# Altium schematic sheet BlasterAmp_SH1.SchDoc
size 647 x 419 mm; SheetNumber: 1; SheetTotal: 1
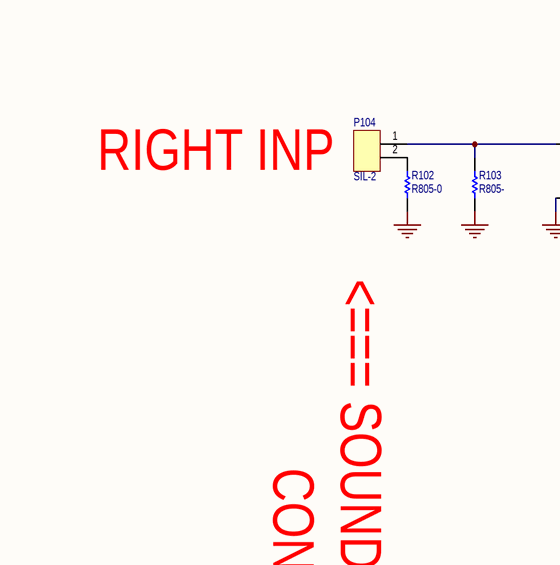
[diagram p0: BlasterAmp_SH1.SchDoc, top left]
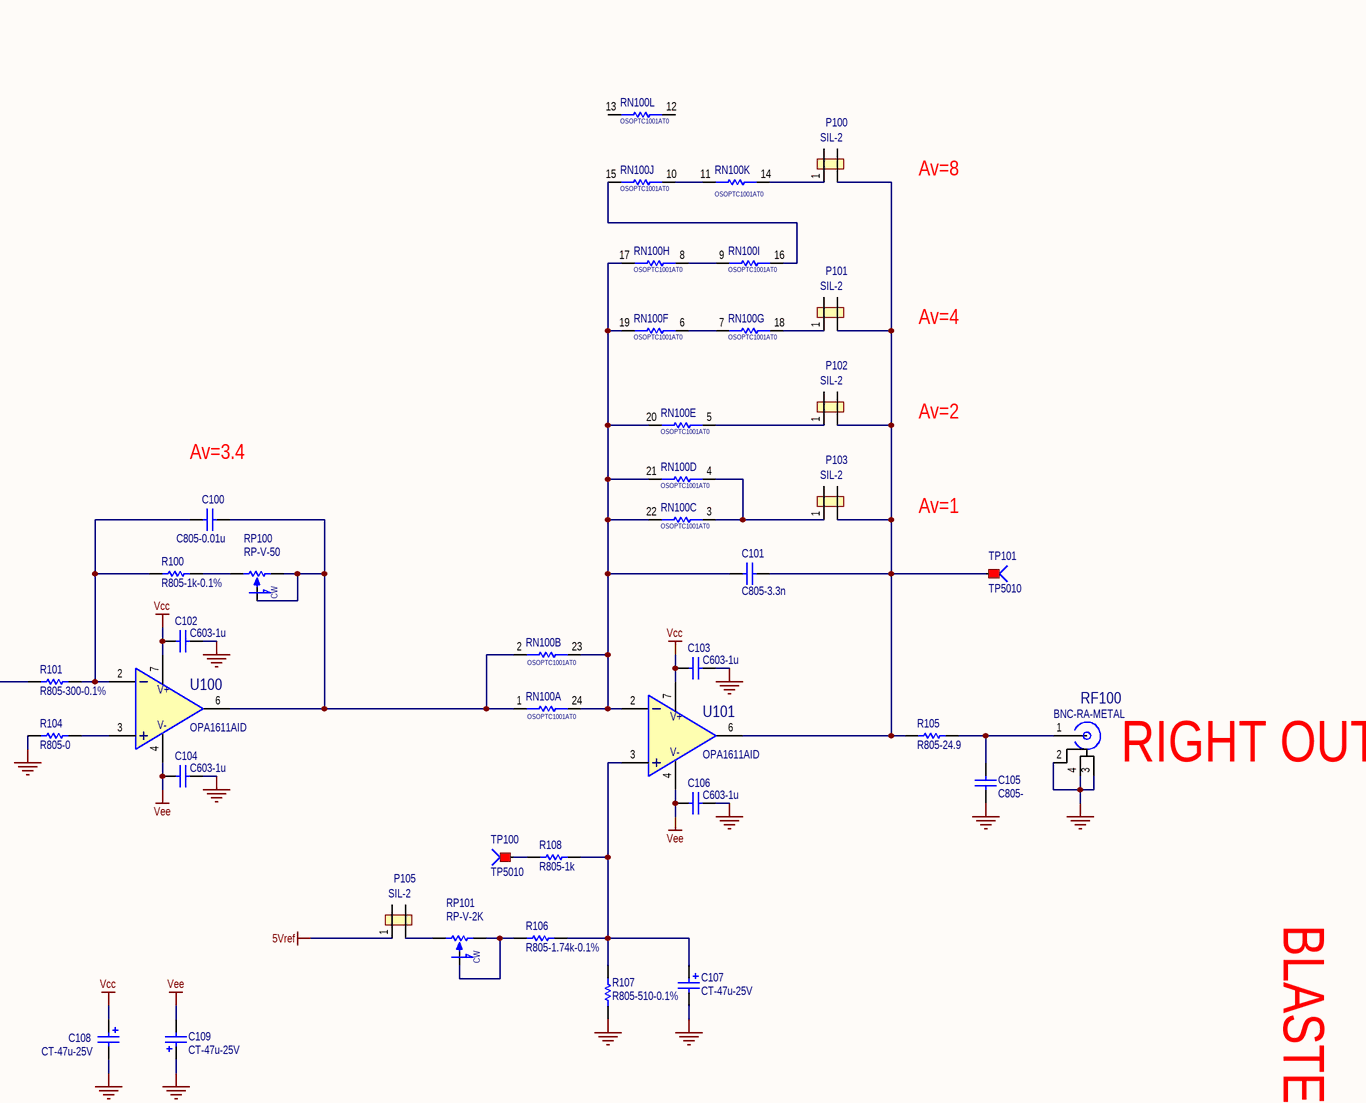
[diagram p1: BlasterAmp_SH1.SchDoc, top right]
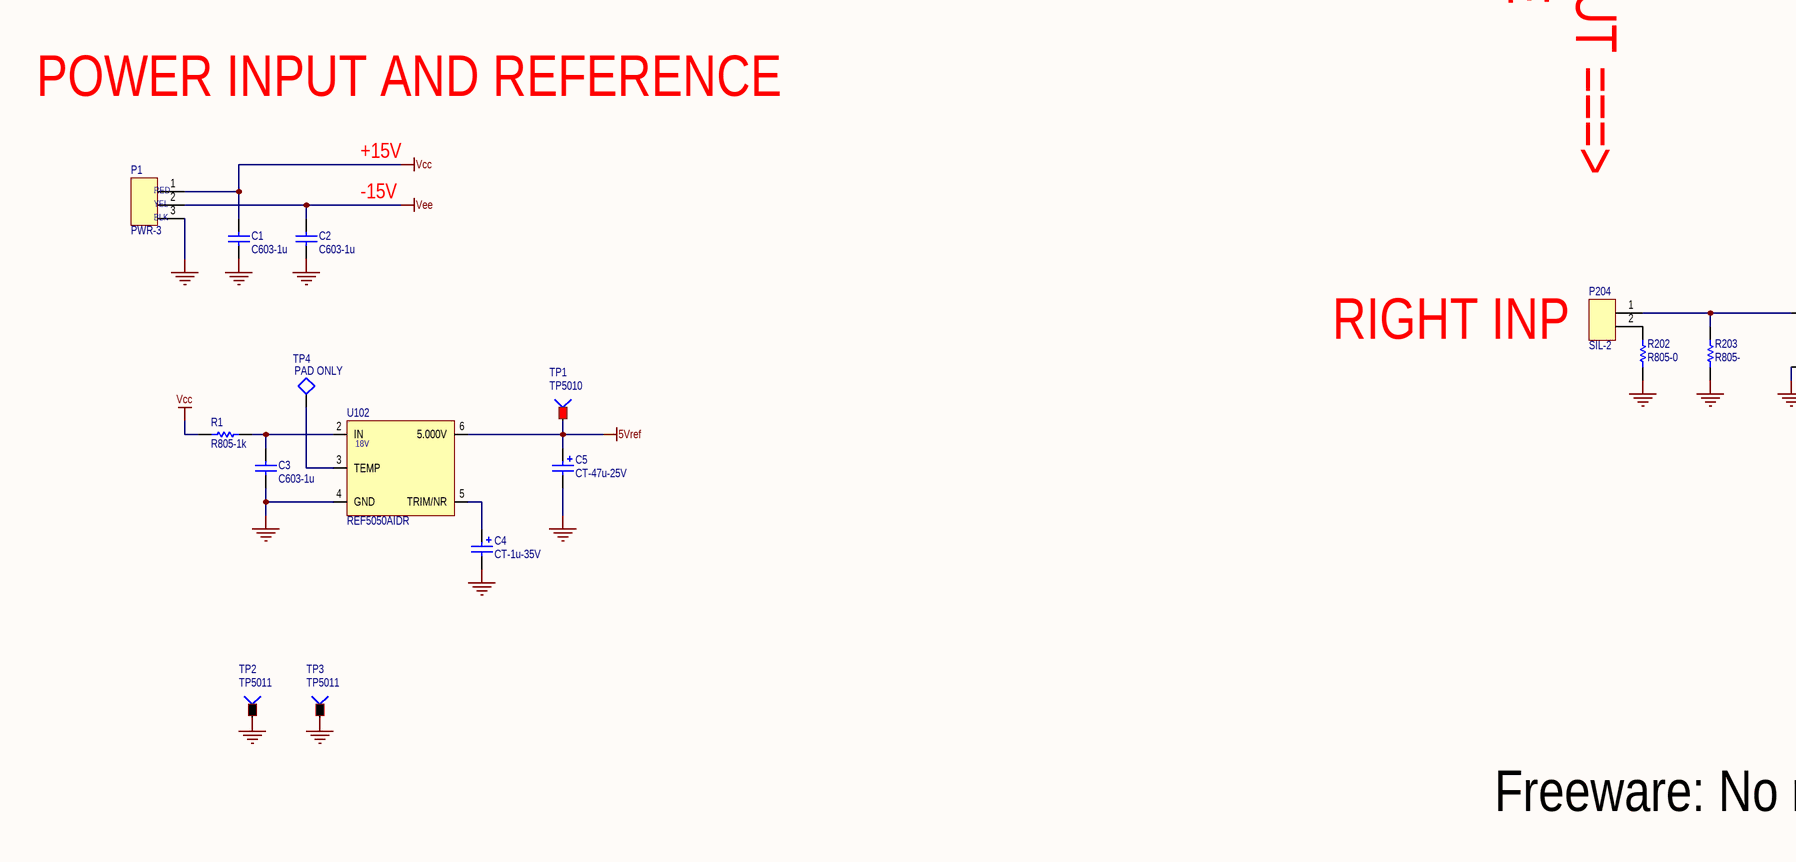
[diagram p2: BlasterAmp_SH1.SchDoc, bottom left]
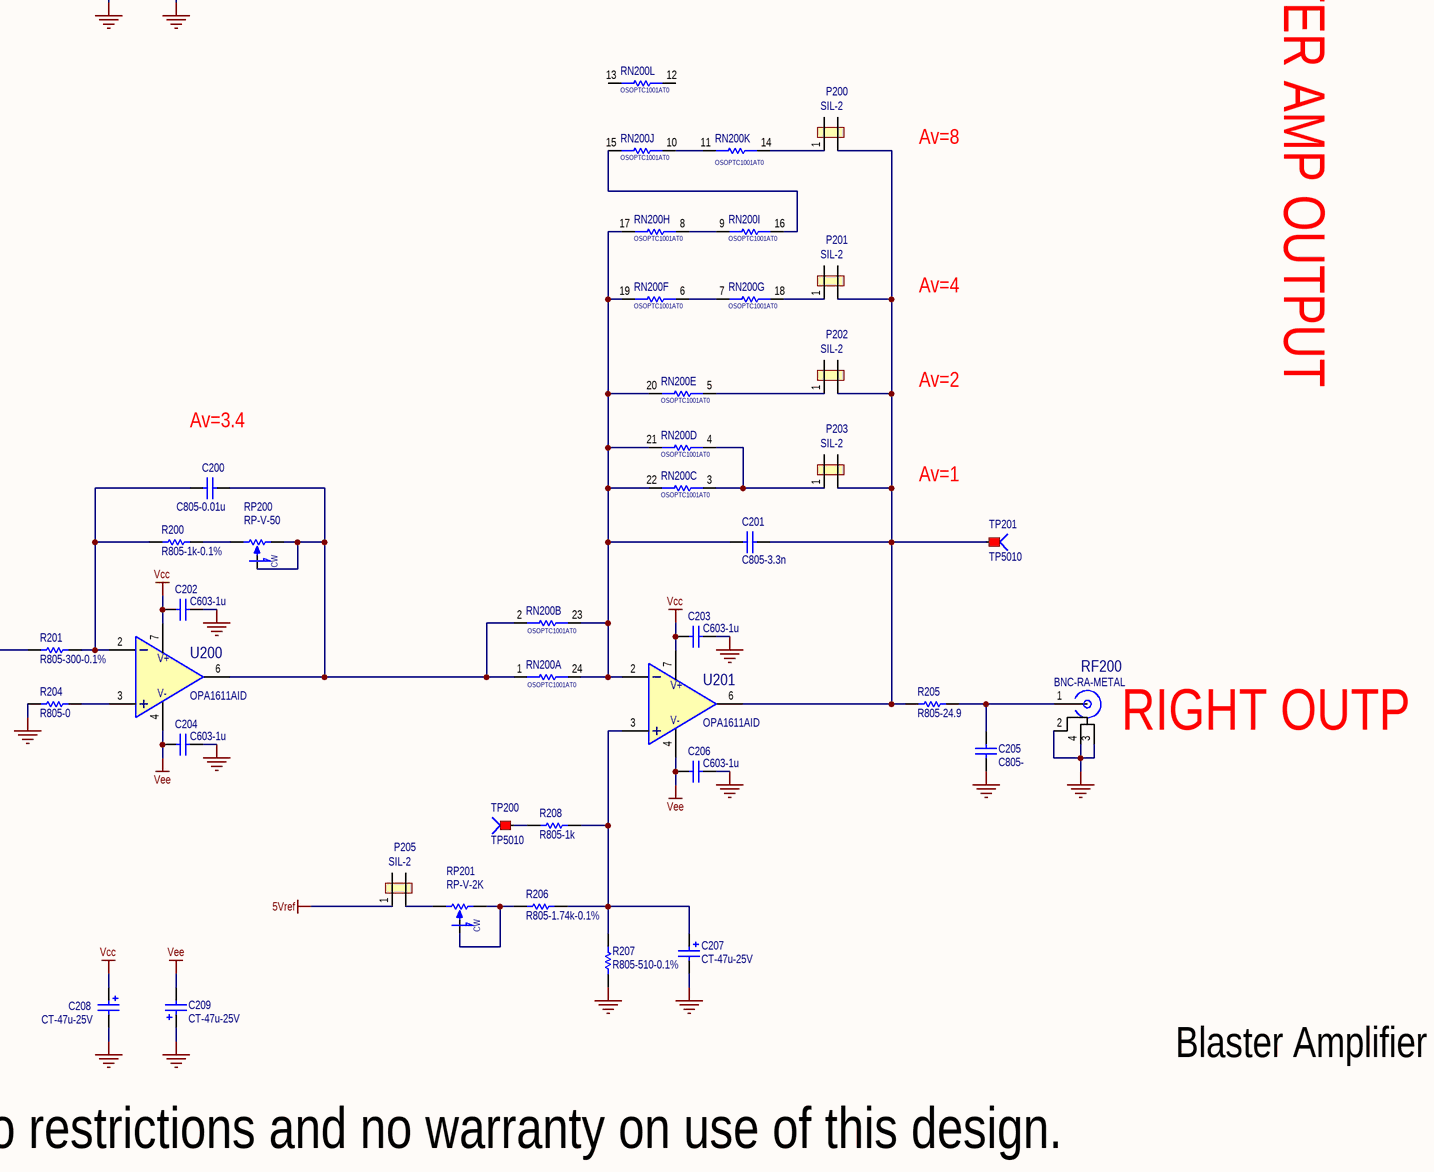
[diagram p3: BlasterAmp_SH1.SchDoc, bottom right]

## Parts
?  (no value)  (graphical)
C1  C603-1u  [0603]
C2  C603-1u  [0603]
C3  C603-1u  [0603]
C4  CT-1u-35V  [3528-21]
C5  CT-47u-25V  [7343-31]
C100  C805-0.01u  [0805]
C101  C805-3.3n  [0805]
C102  C603-1u  [0603]
C103  C603-1u  [0603]
C104  C603-1u  [0603]
C105  C805-  [0805]
C106  C603-1u  [0603]
C107  CT-47u-25V  [7343-31]
C108  CT-47u-25V  [7343-31]
C109  CT-47u-25V  [7343-31]
C200  C805-0.01u  [0805]
C201  C805-3.3n  [0805]
C202  C603-1u  [0603]
C203  C603-1u  [0603]
C204  C603-1u  [0603]
C205  C805-  [0805]
C206  C603-1u  [0603]
C207  CT-47u-25V  [7343-31]
C208  CT-47u-25V  [7343-31]
C209  CT-47u-25V  [7343-31]
P1  PWR-3  [HEADER_PWR_3]
P100  SIL-2  [Header_SIL_2]
P101  SIL-2  [Header_SIL_2]
P102  SIL-2  [Header_SIL_2]
P103  SIL-2  [Header_SIL_2]
P104  SIL-2  [Header_SIL_2]
P105  SIL-2  [Header_SIL_2]
P200  SIL-2  [Header_SIL_2]
P201  SIL-2  [Header_SIL_2]
P202  SIL-2  [Header_SIL_2]
P203  SIL-2  [Header_SIL_2]
P204  SIL-2  [Header_SIL_2]
P205  SIL-2  [Header_SIL_2]
R1  R805-1k  [0805]
R100  R805-1k-0.1%  [0805]
R101  R805-300-0.1%  [0805]
R102  R805-0  [0805]
R103  R805-  [0805]
R104  R805-0  [0805]
R105  R805-24.9  [0805]
R106  R805-1.74k-0.1%  [0805]
R107  R805-510-0.1%  [0805]
R108  R805-1k  [0805]
R200  R805-1k-0.1%  [0805]
R201  R805-300-0.1%  [0805]
R202  R805-0  [0805]
R203  R805-  [0805]
R204  R805-0  [0805]
R205  R805-24.9  [0805]
R206  R805-1.74k-0.1%  [0805]
R207  R805-510-0.1%  [0805]
R208  R805-1k  [0805]
RF100  BNC-RA-METAL  [BNC-RA-METAL]
RF200  BNC-RA-METAL  [BNC-RA-METAL]
RN100  OSOPTC1001AT0  [Vishay_24Pin_RNetwork]  (parts A,B,C,D,E,F,G,H,I,J,K,L of 12)
RN200  OSOPTC1001AT0  [Vishay_24Pin_RNetwork]  (parts A,B,C,D,E,F,G,H,I,J,K,L of 12)
RP100  RP-V-50  [POT_3299W]
RP101  RP-V-2K  [POT_3299W]
RP200  RP-V-50  [POT_3299W]
RP201  RP-V-2K  [POT_3299W]
TP1  TP5010  [TP-RED]
TP2  TP5011  [TP-BLACK]
TP3  TP5011  [TP-BLACK]
TP4  PAD ONLY  [TestPoint]  (no BOM)
TP100  TP5010  [TP-RED]
TP101  TP5010  [TP-RED]
TP200  TP5010  [TP-RED]
TP201  TP5010  [TP-RED]
U100  OPA1611AID  [SOIC-8]
U101  OPA1611AID  [SOIC-8]
U102  REF5050AIDR  [SOIC-8]
U200  OPA1611AID  [SOIC-8]
U201  OPA1611AID  [SOIC-8]

## Nets
5Vref: C5.1 P105.1 P205.1 TP1.1 U102.6(5.000V)
GND: C1.1 C2.1 C3.1 C4.2 C5.2 C102.2 C103.2 C104.2 C105.1 C106.2 C107.2 C108.2 C109.1 C202.2 C203.2 C204.2 C205.1 C206.2 C207.2 C208.2 C209.1 P1.3 R102.1 R103.1 R104.1 R107.1 R202.1 R203.1 R204.1 R207.1 RF100.2 RF100.3 RF100.4 RF200.2 RF200.3 RF200.4 TP2.1 TP3.1 U102.4(GND)
Vcc: C1.2 C102.1 C103.1 C108.1 C202.1 C203.1 C208.1 P1.1 R1.2 U100.7(V+) U101.7(V+) U200.7(V+) U201.7(V+)
Vee: C2.2 C104.1 C106.1 C109.2 C204.1 C206.1 C209.2 P1.2 U100.4(V-) U101.4(V-) U200.4(V-) U201.4(V-)
NetC3_2: C3.2 R1.1 U102.2(IN)
NetC4_1: C4.1 U102.5(TRIM/NR)
NetC100_1: C100.1 R100.1 R101.2 U100.2(-IN)
NetC100_2: C100.2 RN100.1 RN100.2 RP100.2(TAP) RP100.3(BOT) U100.6(OUT)
NetC101_1: C101.1 RN100.17 RN100.19 RN100.20 RN100.21 RN100.22 RN100.23 RN100.24 U101.2(-IN)
NetC101_2: C101.2 P100.2 P101.2 P102.2 P103.2 R105.1 TP101.1 U101.6(OUT)
NetC105_2: C105.2 R105.2 RF100.1
NetC107_1: C107.1 R106.1 R107.2 R108.2 U101.3(+IN)
NetC200_1: C200.1 R200.1 R201.2 U200.2(-IN)
NetC200_2: C200.2 RN200.1 RN200.2 RP200.2(TAP) RP200.3(BOT) U200.6(OUT)
NetC201_1: C201.1 RN200.17 RN200.19 RN200.20 RN200.21 RN200.22 RN200.23 RN200.24 U201.2(-IN)
NetC201_2: C201.2 P200.2 P201.2 P202.2 P203.2 R205.1 TP201.1 U201.6(OUT)
NetC205_2: C205.2 R205.2 RF200.1
NetC207_1: C207.1 R206.1 R207.2 R208.2 U201.3(+IN)
NetP100_1: P100.1 RN100.14
NetP101_1: P101.1 RN100.18
NetP102_1: P102.1 RN100.5
NetP103_1: P103.1 RN100.3 RN100.4
NetP104_1: P104.1 R101.1 R103.2
NetP104_2: P104.2 R102.2
NetP105_2: P105.2 RP101.1(TOP)
NetP200_1: P200.1 RN200.14
NetP201_1: P201.1 RN200.18
NetP202_1: P202.1 RN200.5
NetP203_1: P203.1 RN200.3 RN200.4
NetP204_1: P204.1 R201.1 R203.2
NetP204_2: P204.2 R202.2
NetP205_2: P205.2 RP201.1(TOP)
NetR100_2: R100.2 RP100.1(TOP)
NetR104_2: R104.2 U100.3(+IN)
NetR106_2: R106.2 RP101.2(TAP) RP101.3(BOT)
NetR108_1: R108.1 TP100.1
NetR200_2: R200.2 RP200.1(TOP)
NetR204_2: R204.2 U200.3(+IN)
NetR206_2: R206.2 RP201.2(TAP) RP201.3(BOT)
NetR208_1: R208.1 TP200.1
NetRN100_6: RN100.6 RN100.7
NetRN100_8: RN100.8 RN100.9
NetRN100_10: RN100.10 RN100.11
NetRN100_15: RN100.15 RN100.16
NetRN200_6: RN200.6 RN200.7
NetRN200_8: RN200.8 RN200.9
NetRN200_10: RN200.10 RN200.11
NetRN200_15: RN200.15 RN200.16
NetTP4_1: TP4.1 U102.3(TEMP)

Not connected (* = marked no-connect by the designer): RN100 12 13; RN200 12 13

## Notes on the sheet
- Av=8
- Av=4
- Av=3.4
- Av=2
- Av=1
- (near P104) RIGHT INP
- <=== SOUND CARD OUTPUT ===>
- (near RF100) RIGHT OUTP
- BLASTER AMP OUTPUT
- CONNECTS HERE
- POWER INPUT AND REFERENCE
- +15V
- -15V
- (near P204) RIGHT INP
- (near RF200) RIGHT OUTP
- Blaster Amplifier - V1.0
- Freeware: No restrictions and no warranty on use of this design.
- Title:
- Document Number:
- Rev:
- Drawn by:
- Date:
- Sheet
- of
- (in symbol Header_Pwr_3) RED; YEL; BLK
- (in symbol REF5050AIDR) 18V
- (in symbol RP_Vert) CW

## Library data of the parts
? = Title Block Generic
C1-C3 C102-C104 C106 C202-C204 C206 = C0603-2.2u: 2.2uF 16V X5R 85 Deg C 603 Capacitor; Value: *
C4 = CT-1u-35V: 1uF/35V Tant; Value: *
C5 C107-C109 C207-C209 = CT-47u-25V: 47uF/25V Tant; Value: *
C100 C101 C105 C200 C201 C205 = C0805: 0805 Capacitor; Value: *
P1 = Header_Pwr_3: Header PWR 3PIN
P100-P103 P105 P200-P203 P205 = Jumper 2 Pin: Jumper SIL 2 Pin
P104 P204 = Header_SIL_2: Header SIL 2 Pin
R1 R100-R108 R200-R208 = R0805: 0805 Resistor; Value: *
RF100 RF200 = BNC_RA_METAL: BNC METAL BODY
RN100 RN200 = RNETWORK-1K: Vishay 1k x 12  0.1% R Network
RP100 RP101 RP200 RP201 = RP_Vert: Pot Vert 25 Turn / 3299W; Value: *
TP1 TP100 TP101 TP200 TP201 = TestPoint_Red: TestPoint W/Red Post
TP2 TP3 = TestPoint_Black: TestPoint W/Black Post
TP4 = TestPoint: TestPoint PCB Pad Only
U100 U101 U200 U201 = OPA1611AID: OPAMP SoundPlus RRO +/-18V
U102 = REF5050AIDR: 10.0V REF 0.1% 8ppm 18V